# Altium schematic sheet RPI.SchDoc
size A3; SheetNumber: 3; SheetTotal: 3
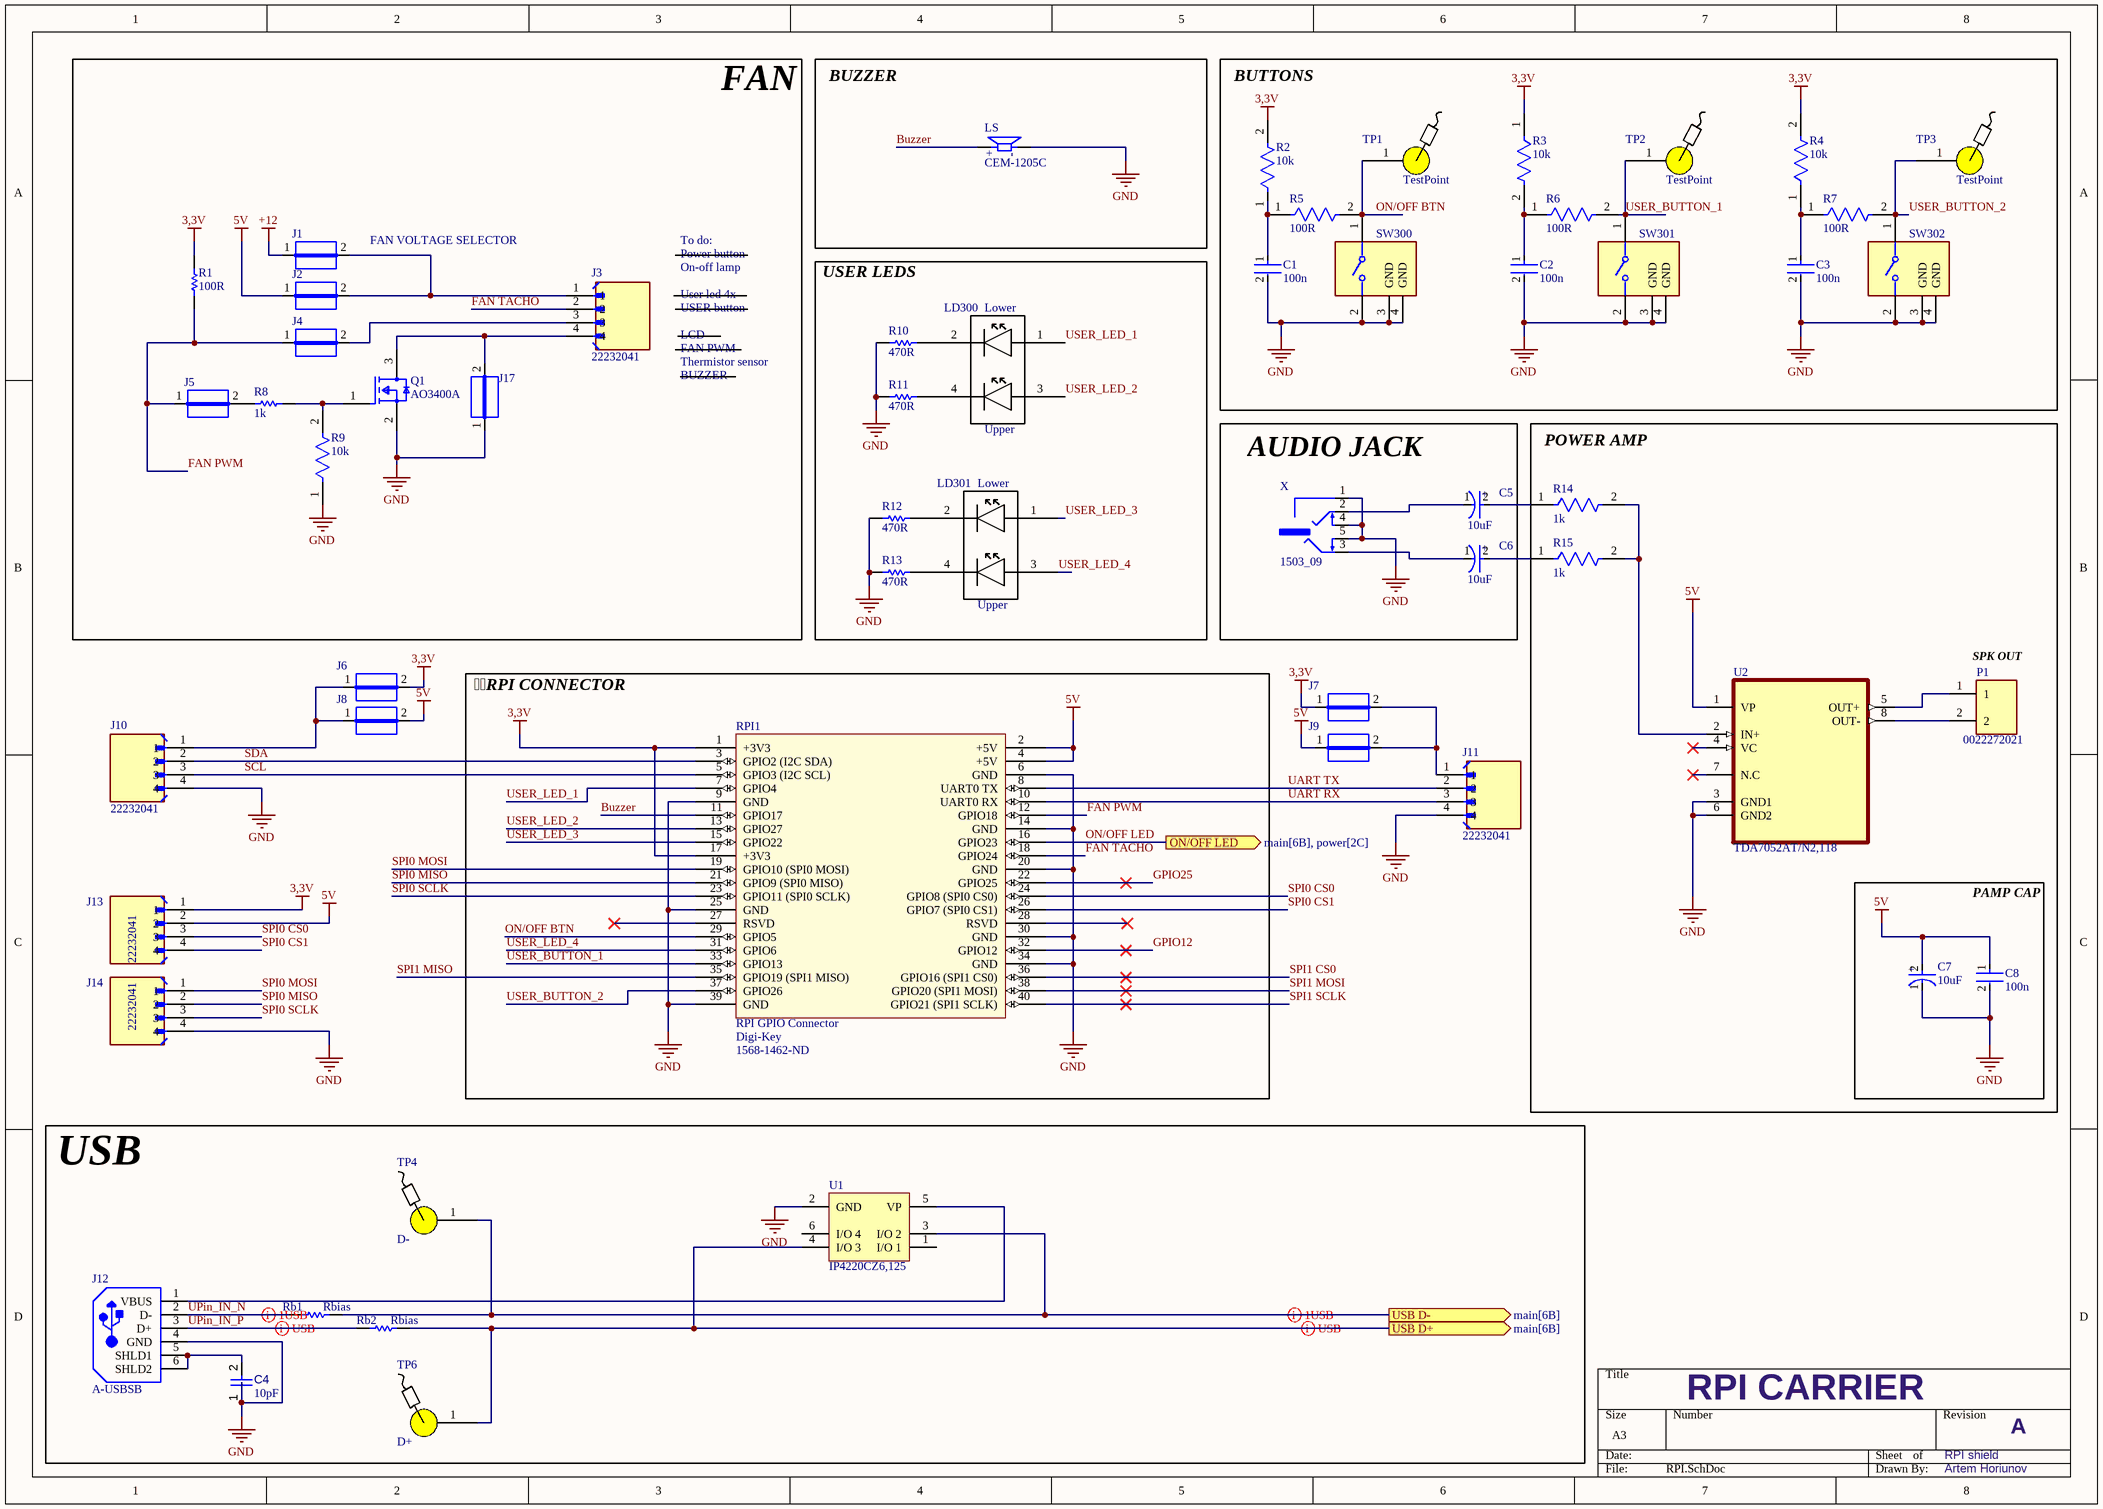
[diagram p0: RPI.SchDoc]

## Parts
C1  100n  [FP-C0603C-CF-MFG]
C2  100n  [FP-C0603C-CF-MFG]
C3  100n  [FP-C0603C-CF-MFG]
C4  value 10pF  [CAPC1005X55X30LL05T10]  (hidden comment: Capacitor 10 pF +/- 0.25 pF 50 V 0402)
C5  10uF  [FP-SC-MFG]
C6  10uF  [FP-SC-MFG]
C7  10uF  [FP-SC-MFG]
C8  100n  [FP-C0603C-CF-MFG]
J1  JUMPER  [JUMPER]  (value not drawn)
J2  JUMPER  [JUMPER]  (value not drawn)
J3  22232041  [MOLEX_22232041]
J4  JUMPER  [JUMPER]  (value not drawn)
J5  JUMPER  [JUMPER]  (value not drawn)
J6  JUMPER  [JUMPER]  (value not drawn)
J7  JUMPER  [JUMPER]  (value not drawn)
J8  JUMPER  [JUMPER]  (value not drawn)
J9  JUMPER  [JUMPER]  (value not drawn)
J10  22232041  [MOLEX_22232041]
J11  22232041  [MOLEX_22232041]
J12  A-USBSB  [ASSM-A-USBSB-4_V]
J13  22232041  [MOLEX_22232041]
J14  22232041  [MOLEX_22232041]
J17  JUMPER  [JUMPER]  (value not drawn)
LD300  (no value)  [LED_HOLDER]
LD301  (no value)  [LED_HOLDER]
LS  CEM-1205C  [CUI_CEM-1205C]
P1  0022272021  [MOLEX_0022272021]
Q1  AO3400A  [FP-SOT23-MFG]
R1  100R  [RESC0603(1608)_N]
R2  10k  [FP-RC0603-0_55-IPC_C]
R3  10k  [FP-RC0603-0_55-IPC_C]
R4  10k  [FP-RC0603-0_55-IPC_C]
R5  100R  [FP-RC0603-0_55-MFG]
R6  100R  [FP-RC0603-0_55-MFG]
R7  100R  [FP-RC0603-0_55-MFG]
R8  1k  [RESC0603(1608)_N]
R9  10k  [FP-RC0603-0_55-IPC_C]
R10  470R  [RESC1608X55X25LL10T15]
R11  470R  [RESC1608X55X25LL10T15]
R12  470R  [RESC1608X55X25LL10T15]
R13  470R  [RESC1608X55X25LL10T15]
R14  1k  [FP-ERA3A-IPC_C]
R15  1k  [FP-ERA3A-IPC_C]
Rb1  Rbias  [RESC1005X40X25NL05T05]
Rb2  Rbias  [RESC1005X40X25NL05T05]
RPI1  RPI GPIO Connector  Supplier 1: Digi-Key  Supplier Part Number 1: 1568-1462-ND  [rpi]
SW300  B3F-3122  [FP-B3F-3122-MFG]  (value not drawn)
SW301  B3F-3122  [FP-B3F-3122-MFG]  (value not drawn)
SW302  B3F-3122  [FP-B3F-3122-MFG]  (value not drawn)
TP1  TestPoint  [TestPoint]  (no BOM)
TP2  TestPoint  [TestPoint]  (no BOM)
TP3  TestPoint  [TestPoint]  (no BOM)
TP4  D-  [TestPoint]  (no BOM)
TP6  D+  [TestPoint]  (no BOM)
U1  IP4220CZ6,125  [NXP-SOT457_L]
U2  TDA7052AT/N2,118  [SOIC127P600X175-8N]
X  1503_09  [1503_09]

## Blocks framed on the sheet
FAN: J1-J5 J17 Q1 R1 R8 R9
BUZZER: LS
BUTTONS: C1-C3 R2-R7 SW300-SW302 TP1-TP3
USER LEDS: LD300 LD301 R10-R13
AUDIO JACK: C5 C6 X
POWER AMP: P1 R14 R15 U2
RPI CONNECTOR: RPI1
PAMP CAP: C7 C8
USB: C4 J12 Rb1 Rb2 TP4 TP6 U1

## Ports
ON/OFF LED (out, see main[6B], power[2C]), USB D+ (out, see main[6B]), USB D- (out, see main[6B])

## Nets
3,3V: J6.2 J7.1 J13.1 R1.2 R2.2 R3.1 R4.2 RPI1.1(+3V3) RPI1.17(+3V3)
5V: C7.2(A) C8.1 J2.1 J8.2 J9.1 J13.2 RPI1.2(+5V) RPI1.4(+5V) U2.1(VP)
+12: J1.1
GND: C1.2 C2.2 C3.2 C4.1 C7.1(C) C8.2 J10.4 J11.4 J12.4(GND) J14.4 J17.1 LS.N Q1.2(S) R9.1 R10.1 R11.1 R12.1 R13.1 RPI1.6(GND) RPI1.9(GND) RPI1.14(GND) RPI1.20(GND) RPI1.25(GND) RPI1.30(GND) RPI1.34(GND) RPI1.39(GND) SW300.2 SW300.3(GND) SW300.4(GND) SW301.2 SW301.3(GND) SW301.4(GND) SW302.2 SW302.3(GND) SW302.4(GND) U1.2(GND) U2.3(GND1) U2.6(GND2) X.1 X.4 X.5
Buzzer: LS.P RPI1.11(GPIO17)
FAN PWM: J4.1 J5.1 R1.1 RPI1.12(GPIO18)
FAN TACHO: J3.2 RPI1.18(GPIO24)
GPIO12: RPI1.32(GPIO12)
GPIO25: RPI1.22(GPIO25)
ON/OFF BTN: R5.2 RPI1.29(GPIO5) SW300.1 TP1.1
ON/OFF LED: RPI1.16(GPIO23) ; port ON/OFF LED
SCL: J10.3 RPI1.5(GPIO3_(I2C_SCL))
SDA: J10.2 RPI1.3(GPIO2_(I2C_SDA))
SPI0 CS0: J13.3 RPI1.24(GPIO8_(SPI0_CS0))
SPI0 CS1: J13.4 RPI1.26(GPIO7_(SPI0_CS1))
SPI0 MISO: J14.2 RPI1.21(GPIO9_(SPI0_MISO))
SPI0 MOSI: J14.1 RPI1.19(GPIO10_(SPI0_MOSI))
SPI0 SCLK: J14.3 RPI1.23(GPIO11_(SPI0_SCLK))
SPI1 CS0: RPI1.36(GPIO16_(SPI1_CS0))
SPI1 MISO: RPI1.35(GPIO19_(SPI1_MISO))
SPI1 MOSI: RPI1.38(GPIO20_(SPI1_MOSI))
SPI1 SCLK: RPI1.40(GPIO21_(SPI1_SCLK))
UART RX: J11.3 RPI1.10(UART0_RX)
UART TX: J11.2 RPI1.8(UART0_TX)
UPin_IN_N: J12.2(D-) Rb1.1
UPin_IN_P: J12.3(D+) Rb2.1
USB D+: Rb2.2 TP6.1 U1.4(I/O_3) ; port USB D+
USB D-: Rb1.2 TP4.1 U1.3(I/O_2) ; port USB D-
USER_BUTTON_1: R6.2 RPI1.33(GPIO13) SW301.1 TP2.1
USER_BUTTON_2: R7.2 RPI1.37(GPIO26) SW302.1 TP3.1
USER_LED_1: LD300.1 RPI1.7(GPIO4)
USER_LED_2: LD300.3 RPI1.13(GPIO27)
USER_LED_3: LD301.1 RPI1.15(GPIO22)
USER_LED_4: LD301.3 RPI1.31(GPIO6)
NetC1_1: C1.1 R2.1 R5.1
NetC2_1: C2.1 R3.2 R6.1
NetC3_1: C3.1 R4.1 R7.1
NetC4_2: C4.2 J12.5(SHLD1) J12.6(SHLD2)
NetC5_1: C5.1(C) X.2
NetC5_2: C5.2(A) R14.1
NetC6_1: C6.1(C) X.3
NetC6_2: C6.2(A) R15.1
NetJ1_2: J1.2 J2.2 J3.1
NetJ3_3: J3.3 J4.2
NetJ3_4: J3.4 J17.2 Q1.3(D)
NetJ5_2: J5.2 R8.2
NetJ6_1: J6.1 J8.1 J10.1
NetJ7_2: J7.2 J9.2 J11.1
NetJ12_1: J12.1(VBUS) U1.5(VP)
NetLD300_2: LD300.2 R10.2
NetLD300_4: LD300.4 R11.2
NetLD301_2: LD301.2 R12.2
NetLD301_4: LD301.4 R13.2
NetP1_1: P1.1 U2.5(OUT+)
NetP1_2: P1.2 U2.8(OUT-)
NetQ1_1: Q1.1(G) R8.1 R9.2
NetR14_2: R14.2 R15.2 U2.2(IN+)

Not connected (* = marked no-connect by the designer): RPI1 27(RSVD)* 28(RSVD)*; U1 1(I/O_1) 6(I/O_4); U2 4(VC)* 7(N.C)*

## Layout directives
differential pair; differential pair class USB: UPin_IN_N, UPin_IN_P, USB D+, USB D-

## Notes on the sheet
- (near J1) FAN VOLTAGE SELECTOR
- To do:
- Power button
- On-off lamp
- User led 4x
- USER button
- LCD
- FAN PWM
- Thermistor sensor
- BUZZER
- (near P1) SPK OUT
- RPI CARRIER
- RPI shield
- A
- Artem Horiunov
- (in symbol CEM-1205C) +; -
- (in symbol CMP-05427-000087-1) +
- (in symbol DoubleStack_Side_Led_3mm) Lower; Upper

## Library data of the parts
C1-C3 C8 = CMP-2006-03061-2: CAP CER 0.1UF 50V X7R 0603; Manufacturer: KEMET; Manufacturer Part Number: C0603C104K5RACTU; Tolerance: 0.1; Temperature Coefficient: 30ppm/°C; Material: Ceramic; Automotive Grade: Grade 1; Value: 0.10 μF; Temperature: -55°C to +125°C; RoHS: TRUE; Temperature Range High: +125°C; Lead Free: Yes; Octopart: https://octopart.com/c0603c104k5ractu-kemet-139244; Digikey Description: CAP CER 0.1UF 50V X7R 0603; Category: Cap; Package: C0603C-CF; ComponentLink2Description: Datasheet; Temperature Range Low: -55°C; Device Class L1: Passive Components; Voltage Rating: 50 V; Automotive: Yes; Device Class L3: Ceramic Capacitors; ComponentLink2URL: https://api.kemet.com/component-edge/download/datasheet/C0603C100J5GACAUTO.pdf; Capacitance: 0.10 μF; Device Class L2: Capacitors; Temperature Characteristic: X7R; Height: 0.87mm
C4 = CMP-001-00011-6: Chip Capacitor, 10 pF, +/- 0.25 pF, 50 V, 0402 (1005 Metric); Voltage Rating: 50V; Tolerance: 0.25%; Capacitor Type: Ceramic; Mounting Technology: SM; Pins: 2; Case/Package: 0402; Min Operating Temperature: -55°C; RoHS Compliant: True; Max Operating Temperature: 125°C
C5-C7 = CMP-05427-000087-1: CAP ALUM 10UF 20% 35V SMD; Life (Hours): 2000Hour; Lead Length: 2.2mm; Ripple Current (AC): 30mA; Leakage Current: 3uA; Length: 5.5mm; Construction: Cylindrical; Diameter: 5mm; RoHS Compliant: Yes; REACH SVHC: No SVHC; Capacitance: 10uF; Max Operating Temperature: 85°C; Series: S; Case/Package: Radial; Contact Plating: Tin; Packaging: Tape and Reel; Voltage Rating: 35V; Number of Pins: 2; Height: 5.4mm; Width: 5.3mm; Voltage Rating (DC): 35V; Mount: Surface Mount; Tolerance: 20%; Lead Pitch: 1.5mm; Radiation Hardening: No; Height - Seated (Max): 0.213inch; Ripple Current: 30mA; Voltage: 35V; Package Quantity: 1; Termination: SMD/SMT; Min Operating Temperature: -40°C
J1 J2 J4-J9 J17 = CMP-009-00061-2: Pins: 2
J3 J10 J11 J13 J14 = 22232041: Conn Wire to Board HDR 4 POS 2.54mm Solder ST Top Entry Thru-Hole KKÂ® Bag; MF: Molex; SnapEDA_Link: https://www.snapeda.com/parts/22232041/Molex/view-part/?ref=snap; Package: None; Value: *; MP: 22232041; Check_prices: https://www.snapeda.com/parts/22232041/Molex/view-part/?ref=eda
J12 = CMP-2000-05874-1: Connector Receptacle, USB Type B, Right Angle, -20 to 85 degC, 4-Pin THD, RoHS, Tray; Manufacturer: ASSMANN WSW; Gender: Female; CAD Drawing: 3DCADModel; Number of Ports: 1; Mounting Type: ThroughHole; Datasheet URL: https://datasheet.ciiva.com/11731/0900766b80da421f-11731321.pdf; Datasheet Version: 12/2009; Manufacturer URL: http://www.assmann.us/; Package Description: 4-Pin Through Hole Device, Body 16.5 x 12.04 mm; Body Orientation: RightAngle; Mounting Technology: ThroughHole; Package Reference: USBSB; Termination Method: Solder
LD300 LD301 = DoubleStack_Side_Led_3mm
LS = CEM-1205C: 12 mm, 5 V, 85 dB, Through Hole, Sealed, Driving Circuit, Magnetic Audio Indicator Buzzer; MF: CUI Devices; Value: *; Package: TO-220 CUI Inc.; CUI_purchase_URL: https://www.cuidevices.com/product/audio/buzzers/audio-indicators/cem-1205c?utm_source=snapeda.com&utm_medium=referral&utm_campaign=snapedaBOM; Price: None; MP: CEM-1205C; Availability: Unavailable; SnapEDA_Link: https://www.snapeda.com/parts/CEM-1205C/CUI%20Devices/view-part/2769846/?ref=snap
P1 = 0022272021: Connector Header Through Hole 2 position 0.100 (2.54mm); MF: Molex; SnapEDA_Link: https://www.snapeda.com/parts/0022272021/Molex/view-part/?ref=snap; Package: None; Value: *; MP: 0022272021; Check_prices: https://www.snapeda.com/parts/0022272021/Molex/view-part/?ref=eda
Q1 = CMP-83955-000006-1: MOSFET N-CH 30V 5.7A SOT23; Input Capacitance: 630pF; Number of Elements: 1; Rds On Max: 26.5mR; Max Power Dissipation: 1.4W; Gate to Source Voltage (Vgs): 12V; Min Operating Temperature: -55°C; Lead Free: Lead Free; Number of Pins: 3; Drain to Source Voltage (Vdss): 30V; Case/Package: SOT-23; Mount: Surface Mount; Continuous Drain Current (ID): 5.7A; Radiation Hardening: No; Packaging: Tape and Reel; Max Operating Temperature: 150°C; Power Dissipation: 1.4W
R1 = CMP-1012-00081-1: 0.1W 1% 0603 (1608 Metric)  SMD; Tolerance: 5 %; Case-Metric: 1608; Value: 2000.00 Ohm; Case-EIA: 0603; Technology: SMT; Power: 0.1 W
R2-R4 R9 = CMP-2100-03664-2: RES 10K OHM 1% 1/10W 0603; Voltage Rating: 75V; Voltage Rating (DC): 50V; Resistance: 10kR; Power Rating: 100mW; Temperature Coefficient: 100ppm/°C; Depth: 0.8mm; Termination: SMD/SMT; Resistor Type: Thick Film; Series: RC; Construction: Rectangular; Features: Moisture Resistant; Packaging: Tape and Reel; Min Operating Temperature: -55°C; Number of Terminations: 2; Lead Pitch: 0.3mm; RoHS Compliant: Yes; Case/Package: 0603; Resistance Tolerance: 1%; Military Standard: Not; Weight: 7.1E-05oz; Number of Pins: 2; Tolerance: 1%; Length: 1.6mm; Case Code (Imperial): 0603; Lead Free: Lead Free; Width: 0.8mm; Max Power Dissipation: 100mW; Height: 0.45mm; Max Operating Temperature: 155°C; Case Code (Metric): 1608; Size Code: 0603
R5-R7 = CMP-2100-03663-2: NexarPartId: 55402879; Voltage Rating: 50V; Power Rating: 100mW; Tolerance: 1%; Temperature Coefficient: 100ppm/°C; Resistance: 100Ω; Case/Package: 0603; Military Standard: Not; REACH SVHC: Unknown; Case Code (Metric): 0603; Max Operating Temperature: 155°C; Schedule B: 8533210045, 8533210045; Height: 450µm; Length: 1.6mm; Lead Free: Lead Free; Packaging: Tape & Reel; Case Code (Imperial): 0603; Composition: Thick Film; Min Operating Temperature: -55°C; Voltage Rating (DC): 50V; RoHS: Compliant; Depth: 800µm; Number of Pins: 2; Termination: SMD/SMT; Width: 800µm
R8 = CMP-1012-00081-1: 0.1W 5% 0603 (1608 Metric)  SMD; Case-Metric: 1608; Value: 2000.00 Ohm; Case-EIA: 0603; Tolerance: 5 %; Technology: SMT; Power: 0.1 W
R10-R13 = CMP-1659-00035-2: General Purpose Chip Resistor, 470 Ohm, +/- 1%, -55 to 155 degC, 0603 (1608 Metric), RoHS, Tape and Reel; Resistance: 470 Ohm; ComponentLink1Description: Manufacturer URL; Contact Plating: Gold; Width: 3.1 mm; Radiation Hardening: No; DatasheetVersion: Rev. 4, 04/2009; Length: 3 mm; PackageDescription: 2-Pin Surface Mount Device, Body 1.6 x 0.8 mm; ComponentLink1URL: http://www.yageo.com/; Min Operating Temperature: -40 degC; Mount: Surface Mount; Package Quantity: 2500; ComponentLink2URL: https://datasheet.ciiva.com/11808/0900766b80f96399-11808177.pdf; RoHSCompliant: true; Fastening Type: Snap; PackageReference: 0603; Max Operating Temperature: 90 degC; Height: 1.25 mm; Packaging: Tape and Reel; ComponentLink2Description: Datasheet; Contact Material: Brass
R14 R15 = CMP-2000-00873-2: RES SMD 1K OHM 0.1% 1/10W 0603; Temperature Coefficient: 25ppm/°C; Voltage Rating: 75V; Max Power Dissipation: 100mW; Resistance: 1kR; Technology: METAL FILM; Number of Pins: 2; Packaging: Tape and Reel; Case Code (Imperial): 0603; Case Code (Metric): 1608; Min Operating Temperature: -55°C; REACH SVHC: No SVHC; Length: 1.6mm; Termination: SMD/SMT; Depth: 0.8mm; Resistance Tolerance: 0.1%; Number of Terminations: 2; Width: 0.8mm; Military Standard: Not; Tolerance: 0.1%; Package Quantity: 5000; Contact Plating: Tin; Height: 0.45mm; Construction: Rectangular; Case/Package: 0603; Max Operating Temperature: 155°C; Resistor Type: Thin Film; Series: ERA-3A; Size Code: 0603; RoHS Compliant: Yes; Mount: Surface Mount; Radiation Hardening: No; Power Rating: 100mW
Rb1 Rb2 = CMP-2002-08143-1: Part Number: CRCW040210R0FKED; Manufacturer: Vishay Dale
RPI1 = rpi connector: GPIO Header for Raspberry Pi A+/B+/Pi 2/Pi 3 - 2x20; Manufacturer: SparkFun Electronics; Manufacturer Part Number: PRT-14017; Nils Minor: author; nilsminor@web.de: mail; RoHS: RoHS Compliant; Category: Development Boards, Kits, Programmers; Stock 1: 150; Pricing 1: 1=1.84 (EUR); Part Status: Active; Accessory Type: Connector; For Use With/Related Products: Raspberry Pi; ComponentLink1URL: https://cdn.sparkfun.com/datasheets/Dev/RaspberryPi/12313.pdf; ComponentLink1Description: https://cdn.sparkfun.com/datasheets/Dev/RaspberryPi/12313.pdf
SW300-SW302 = CMP-08834-000053-1: SWITCH TACTILE SPST-NO 0.05A 24V; Max Current Rating: 50mA; Actuator Type: Standard; Ratings: IP00; Number of Poles: 1; Mechanical Life: 300000Cycles; Illumination Type: Non-Illuminated; Switch Function: Off-Mom; Actuator Color: Grey; Contact Resistance: 100mR; Throw Configuration: SPST; Actuator Length: 1.6mm; Switch Travel: 0.25mm; Operating Force: 1.47N; Weight: 0.25g; Voltage Rating (DC): 24V; Contact Plating: Gold; RoHS Compliant: Yes; Contact Material: Gold; Radiation Hardening: No; Packaging: Bulk; Height: 7.4mm; Min Operating Temperature: -25°C; Electrical Life: 300000Cycles; Depth: 7.85mm; Max Voltage Rating (DC): 24V; Mount: Through Hole; Width: 6.25mm; Current Rating: 50mA; Lead Free: Lead Free; Max Operating Temperature: 70°C; Series: B3F; Contact Current Rating: 50mA; Package Quantity: 1000; Termination: PC Pins; Orientation: Right Angle; Length: 7.3mm
TP4 TP6 = TestPoint
U1 = CMP-2000-06457-1: Dual USB 2.0 integrated ESD protection, 0 to 5.5 V, -40 to 85 degC, 6-Pin TSOP (SOT457), RoHS, Tape and Reel; Manufacturer: NXP Semiconductors; Product Height (mm): 1mm; Rad Hardened: No; Package Version: 06-03-16, 03/2006; Product Length (mm): 3.1mm; VIN Max: 5.5V; Configuration: Quad; Suppressor Type: DiodeArrays; Number of Channels: 4; VF: 0.7V; Capacitance Value: 1.2pF; Product Depth (mm): 1.7mm; VIN Min: 0V; Leakage Current (Max): 0.1uA; ESD Protection Voltage: 8KV@ContactDisc; Direction Type: Uni-Directional; Manufacturer URL: http://www.nxp.com/; Package Reference: SOT457; Datasheet URL: http://cache.nxp.com/documents/data_sheet/IP4220CZ6.pdf; Operating Temperature Max Deg. C: 85C; Packaging: TapeandReel; Package Description: 6-Pin Thin Small Outline Package, Body 2.9 x 1.5 mm, Pitch 0.95 mm; PartNumber: IP4220CZ6; Mounting Technology: SurfaceMount; Working Voltage (Max): 5.5V; Operating Temperature Min Deg. C: -40C; Working Voltage: 5.5V; Package / Case: TSOP; Package URL: http://www.nxp.com/documents/outline_drawing/sot457_po.pdf; Leakage Current: 0.1uA; Pin Count: 6; Mounting Style: SurfaceMount; Datasheet Version: Rev. 5, 07/2011
U2 = TDA7052AT/N2,118: 1 W BTL mono audio amplifier with DC volume control; Package: None; Price: None; Value: *; MP: TDA7052AT/N2,118; Availability: Unavailable
X = 1503_09: 1503 - Lumberg 3.5mm Right Angle Jack Chassis Socket; MP: 1503 09; MF: NEC; Value: *; Package: None; Availability: Unavailable; SnapEDA_Link: https://www.snapeda.com/parts/1503%2009/NEC/view-part/4795369/?ref=snap; Price: None; Toby_UK-Purchase-URL: https://snapeda.com/shop?store=Toby+UK&id=4795369